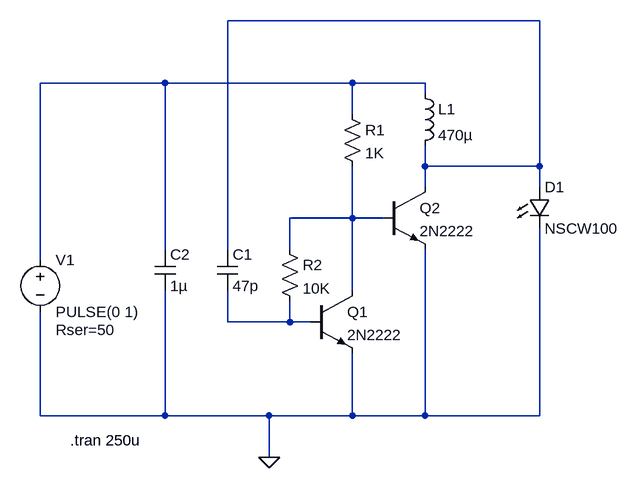
[diagram p0: schematic white led circuit joule thief schematic.asc]
white led circuit joule thief schematic.asc, the LTspice schematic file:
Version 4
SHEET 1 952 680
WIRE 544 -208 64 -208
WIRE -32 -112 -224 -112
WIRE 256 -112 -32 -112
WIRE 368 -112 256 -112
WIRE 368 -96 368 -112
WIRE 256 -64 256 -112
WIRE 368 16 368 -16
WIRE 544 16 544 -208
WIRE 544 16 368 16
WIRE 368 48 368 16
WIRE 544 48 544 16
WIRE 256 96 256 16
WIRE 256 96 160 96
WIRE 304 96 256 96
WIRE -32 144 -32 -112
WIRE 64 144 64 -208
WIRE 160 144 160 96
WIRE -224 160 -224 -112
WIRE 256 208 256 96
WIRE 64 256 64 208
WIRE 160 256 160 224
WIRE 160 256 64 256
WIRE 192 256 160 256
WIRE -224 400 -224 240
WIRE -32 400 -32 208
WIRE -32 400 -224 400
WIRE 128 400 -32 400
WIRE 256 400 256 304
WIRE 256 400 128 400
WIRE 368 400 368 144
WIRE 368 400 256 400
WIRE 544 400 544 112
WIRE 544 400 368 400
WIRE 128 464 128 400
FLAG 128 464 0
SYMBOL npn 192 208 R0
SYMATTR InstName Q1
SYMATTR Value 2N2222
SYMBOL npn 304 48 R0
SYMATTR InstName Q2
SYMATTR Value 2N2222
SYMBOL voltage -224 144 R0
WINDOW 123 0 0 Left 2
WINDOW 39 24 124 Left 2
SYMATTR InstName V1
SYMATTR Value PULSE(0 1)
SYMATTR SpiceLine Rser=50
SYMBOL ind 352 -112 R0
SYMATTR InstName L1
SYMATTR Value 470µ
SYMATTR SpiceLine Ipk=0.062 Rser=26 Rpar=265465 Cpar=2.826p mfg="Wurth Elektronik" pn="74476624 WE-GF 1812"
SYMBOL res 240 -80 R0
SYMATTR InstName R1
SYMATTR Value 1K
SYMATTR SpiceLine tol=1 pwr=0.1
SYMBOL res 144 128 R0
SYMATTR InstName R2
SYMATTR Value 10K
SYMATTR SpiceLine tol=1 pwr=0.1
SYMBOL cap 48 144 R0
SYMATTR InstName C1
SYMATTR Value 47p
SYMBOL LED 528 48 R0
SYMATTR InstName D1
SYMATTR Value NSCW100
SYMATTR Description Diode
SYMATTR Type diode
SYMBOL cap -48 144 R0
SYMATTR InstName C2
SYMATTR Value 1µ
SYMATTR SpiceLine V=10 Irms=10.541 Rser=0.004 Lser=0
TEXT -178 438 Left 2 !.tran 250u

The netlist it stands for:
* white led circuit joule thief schematic.asc
Q1 N003 N004 0 0 2N2222
Q2 N001 N003 0 0 2N2222
V1 N002 0 PULSE(0 1) Rser=50
L1 N002 N001 470µ Ipk=0.062 Rser=26 Rpar=265465 Cpar=2.826p mfg="Wurth Elektronik" pn="74476624 WE-GF 1812"
R1 N002 N003 1K tol=1 pwr=0.1
R2 N003 N004 10K tol=1 pwr=0.1
C1 N001 N004 47p
D1 N001 0 NSCW100
C2 N002 0 1µ V=10 Irms=10.541 Rser=0.004 Lser=0
.model D D
.lib standard.dio
.model NPN NPN
.model PNP PNP
.lib standard.bjt
.tran 250u
.backanno
.end